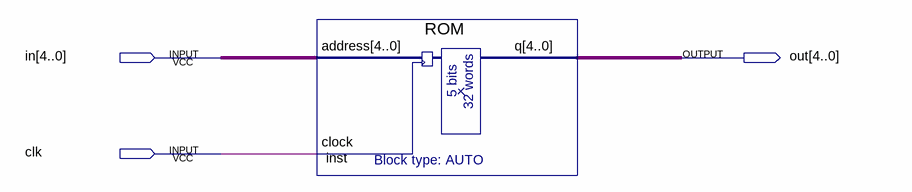
[diagram p0: schematic sheet]
// Quartus schematic ROMschem.bdf as structural Verilog: 1 symbols, 3 pins
module ROMschem (
  input  [4:0] in,
  input  clk,
  output [4:0] out
);

  ROM inst (.address(in), .clock(clk), .q(out));
endmodule
